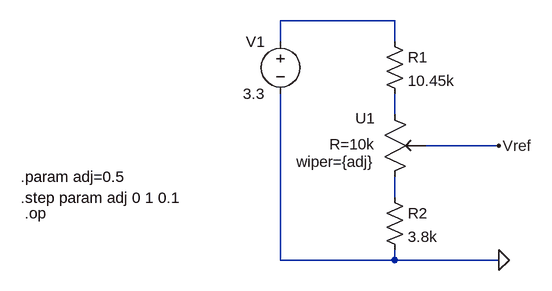
[diagram p0: schematic voltage_reference_pot.asc]
voltage_reference_pot.asc, the LTspice schematic file:
Version 4
SHEET 1 1504 1012
WIRE 240 32 64 32
WIRE 64 64 64 32
WIRE 240 64 240 32
WIRE 240 176 240 144
WIRE 400 224 288 224
WIRE 240 304 240 272
WIRE 64 400 64 144
WIRE 240 400 240 384
WIRE 240 400 64 400
WIRE 400 400 240 400
FLAG 400 400 0
FLAG 400 224 Vref
SYMBOL voltage 64 48 M0
SYMATTR InstName V1
SYMATTR Value 3.3
SYMBOL res 224 48 R0
SYMATTR InstName R1
SYMATTR Value 10.45k
SYMBOL pot 240 272 M0
SYMATTR InstName U1
SYMATTR SpiceLine R=10k
SYMATTR SpiceLine2 wiper={adj}
SYMBOL res 224 288 R0
SYMATTR InstName R2
SYMATTR Value 3.8k
TEXT -336 272 Left 2 !.param adj=0.5
TEXT -336 304 Left 2 !.step param adj 0 1 0.1
TEXT -330 328 Left 2 !.op

The netlist it stands for:
* voltage_reference_pot.asc
V1 N001 0 3.3
R1 N001 N002 10.45k
XU1 N002 N003 Vref pot R=10k wiper={adj}  ; pins 1 2 3
R2 N003 0 3.8k
.param adj=0.5
.step param adj 0 1 0.1
.op
.lib pot.lib
.backanno
.end